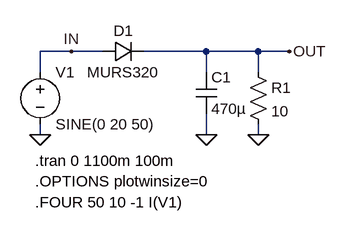
[diagram p0: schematic Fig_3-35_FOUR_PF-Test.asc]
Fig_3-35_FOUR_PF-Test.asc, the LTspice schematic file:
Version 4
SHEET 1 880 680
WIRE 128 96 80 96
WIRE 176 96 128 96
WIRE 336 96 240 96
WIRE 416 96 336 96
WIRE 464 96 416 96
WIRE 80 128 80 96
WIRE 336 128 336 96
WIRE 416 128 416 96
WIRE 80 224 80 208
WIRE 336 224 336 192
WIRE 416 224 416 208
FLAG 80 224 0
FLAG 416 224 0
FLAG 336 224 0
FLAG 128 96 IN
FLAG 464 96 OUT
SYMBOL voltage 80 112 R0
WINDOW 123 0 0 Left 2
WINDOW 39 0 0 Left 2
SYMATTR InstName V1
SYMATTR Value SINE(0 20 50)
SYMBOL diode 176 112 R270
WINDOW 0 32 32 VTop 2
WINDOW 3 0 32 VBottom 2
SYMATTR InstName D1
SYMATTR Value MURS320
SYMBOL cap 320 128 R0
SYMATTR InstName C1
SYMATTR Value 470µ
SYMBOL res 400 112 R0
SYMATTR InstName R1
SYMATTR Value 10
TEXT 72 264 Left 2 !.tran 0 1100m 100m
TEXT 72 296 Left 2 !.OPTIONS plotwinsize=0
TEXT 72 328 Left 2 !.FOUR 50 10 -1 I(V1)

The netlist it stands for:
* Fig_3-35_FOUR_PF-Test.asc
V1 IN 0 SINE(0 20 50)
D1 IN OUT MURS320
C1 OUT 0 470µ
R1 OUT 0 10
.model D D
.lib standard.dio
.tran 0 1100m 100m
.OPTIONS plotwinsize=0
.FOUR 50 10 -1 I(V1)
.backanno
.end